# Altium schematic sheet Sheet_2.SchDoc
size 209 x 297 mm; Address1: Address1; Address2: Address2; Address3: Address3; Address4: Address4; DocumentNumber: АБВГ.123456.001 Э3; SheetNumber: 1; SheetTotal: 1; Scale: 1:1; DocumentType: Схема электрическая принципиальная; FirstReferrence: АБВГ.123456.001
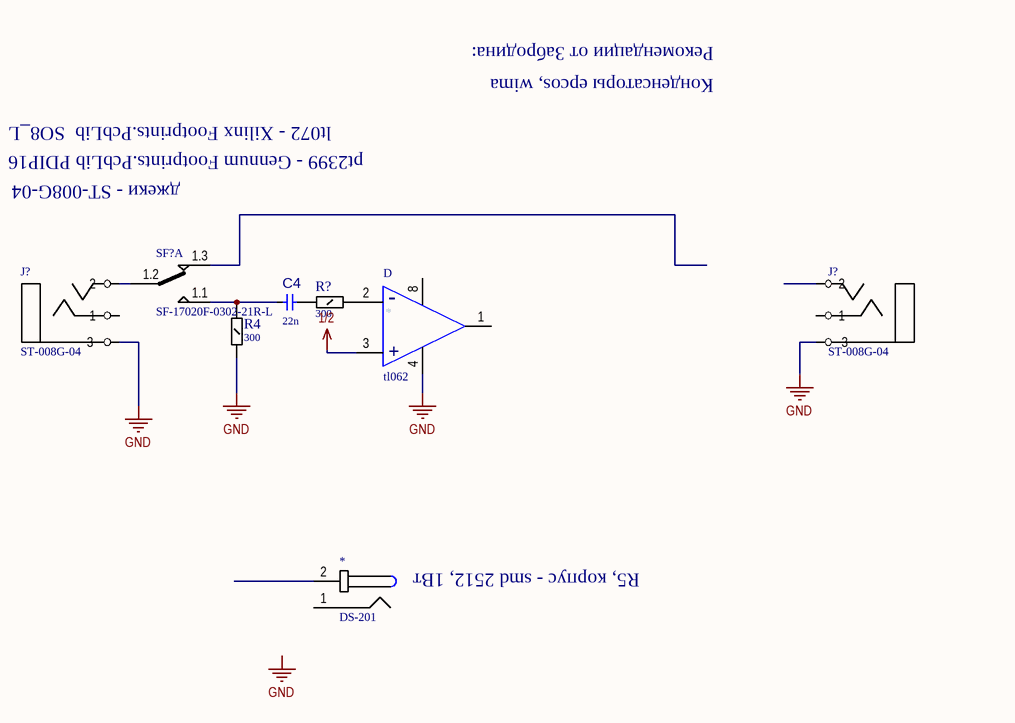
[diagram p0: Sheet_2.SchDoc]

## Parts
(Parts that share a designator on the sheet are numbered #1, #2 ... from top to bottom, then left to right.)
*  DS-201  [DS-201]
C4  value 22n  [C1210]  (hidden comment: C1210)
D  tl062
J?#1  ST-008G-04  [ST-008G-04]
J?#2  ST-008G-04  [ST-008G-04]
R4  value 300  [R1206]  (hidden comment: R1206-0,25 W)
R?  value 300  [R1206]  (hidden comment: R1206-0,25 W)
SF?  SF-17020F-0302-21R-L  [SF-17020F-0302-21R-L]  (part A of 3)

## Nets
1/2: D.3(Vp)
GND: D.4(Vn) J?#1.3 J?#2.3 R4.1
NetC4_1: C4.1 R4.2 SF?.1.1
NetC4_2: C4.2 R?.1
NetD_2: D.2(GND) R?.2

Not connected (* = marked no-connect by the designer): * 1 2; D 1(Q) 5(LE/HYS) 8; J?#1 1 2; J?#2 1 2; SF? 1.2 1.3

## Notes on the sheet
- Рекомендации от Забродина:
- Конденсаторы epcos, wima
- джеки - ST-008G-04
- lt072 - Xilinx Footprints.PcbLib  SO8_L
- pt2399 - Gennum Footprints.PcbLib PDIP16
- (near *) R5, корпус - smd 2512, 1Вт
- Labels drawn without touching a wire or pin: GND
- Перв. примен.
- Справ. №
- Подп. и дата
- Инв. № дубл.
- Взам. инв. №
- Разраб.
- Изм.
- Лист
- № докум.
- Подп.
- Дата
- Лит.
- Масса
- Масштаб
- Пров.
- Т.контр.
- Листов
- Инв. № подл.
- Утв.
- Н.контр.
- 2.106-A4
- Копировал
- Формат А4
- (in symbol tl062) -; +

## Library data of the parts
C4 = Condensator 1210 47mk: TitAD: Конденсатор; Part Number: Condensator 1210 47mk
R4 R? = Resistor 1206 300: TitAD: Резистор; Part Number: Resistor 1206 300; Корпус: R1206